# Altium schematic sheet Main.SchDoc: UVSD_HABalloon_OBC
size A3; DrawnBy: Evan Peters; Revision: 1; SheetNumber: 1; SheetTotal: 4
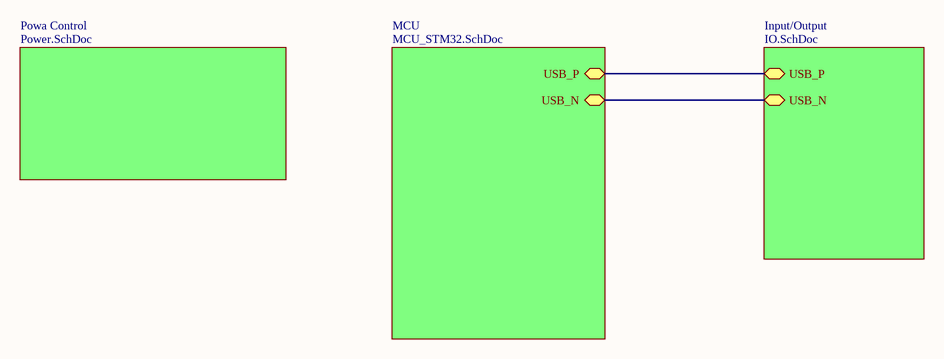
[diagram p0: Main.SchDoc]

## Sub-sheets
Input/Output = IO.SchDoc: USB_P (bidir), USB_N (bidir)
MCU = MCU_STM32.SchDoc: USB_P (bidir), USB_N (bidir)
Powa Control = Power.SchDoc: no entries

## Nets
(unnamed): sheet MCU/USB_P, sheet Input/Output/USB_P
(unnamed): sheet MCU/USB_N, sheet Input/Output/USB_N